# EAGLE schematic Ir water sensor (EAGLE 9.7.0)
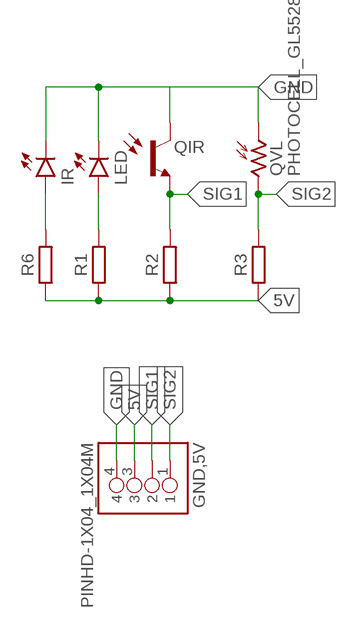
[diagram p0: schematic, sheet 1]

## Parts
GND,5V  PINHD-1X04_1X04M  [1X04]
IR  LED_WHITE  LED_RADIAL_WHITE  [LEDRD254W60D565H860B_W]
LED  LED_WHITE  LED_RADIAL_WHITE  [LEDRD254W60D565H860B_W]
QIR  PHOTOTRANSISTOR  [SENRD254W50D503H320B]
QVL  PHOTOCELL_GL5528  [GL5528]
R1  RESISTOR__CHIP-0805(2012-METRIC)  [RESC2012X65]
R2  RESISTOR__CHIP-0805(2012-METRIC)  [RESC2012X65]
R3  RESISTOR__CHIP-0805(2012-METRIC)  [RESC2012X65]
R6  RESISTOR__CHIP-0805(2012-METRIC)  [RESC2012X65]

## Nets
5V: GND,5V.3 R1.1 R2.1 R3.1 R6.1
GND: GND,5V.4 IR.2(C) LED.2(C) QVL.1
N$2: IR.1(A) R6.2
N$3: LED.1(A) R1.2
N$4: QIR.2(C)
SIG1: GND,5V.2 QIR.1(E) R2.2
SIG2: GND,5V.1 QVL.2 R3.2

## Library data of the parts
GND,5V = Tinkercad:PINHD-1X04
IR LED = Tinkercad:LED_RADIAL: LED - Generic; CATEGORY: Opto-Electronic; SUB-CATEGORY: LED
QIR = Tinkercad:PHOTOTRANSISTOR: Phototransistor / Ambient light sensor Reference Datasheet <https://everlighteurope.com/index.php?controller=attachment&id_attachment=5172>
QVL = Tinkercad:PHOTOCELL: Photoresistor / Photoconductive cells Reference Datasheet <https://www.sunrom.com/get/753444>
R1-R3 R6 = Tinkercad:RESISTOR: Resistor Fixed - Generic; CATEGORY: Resistor; SUB-CATEGORY: Fixed